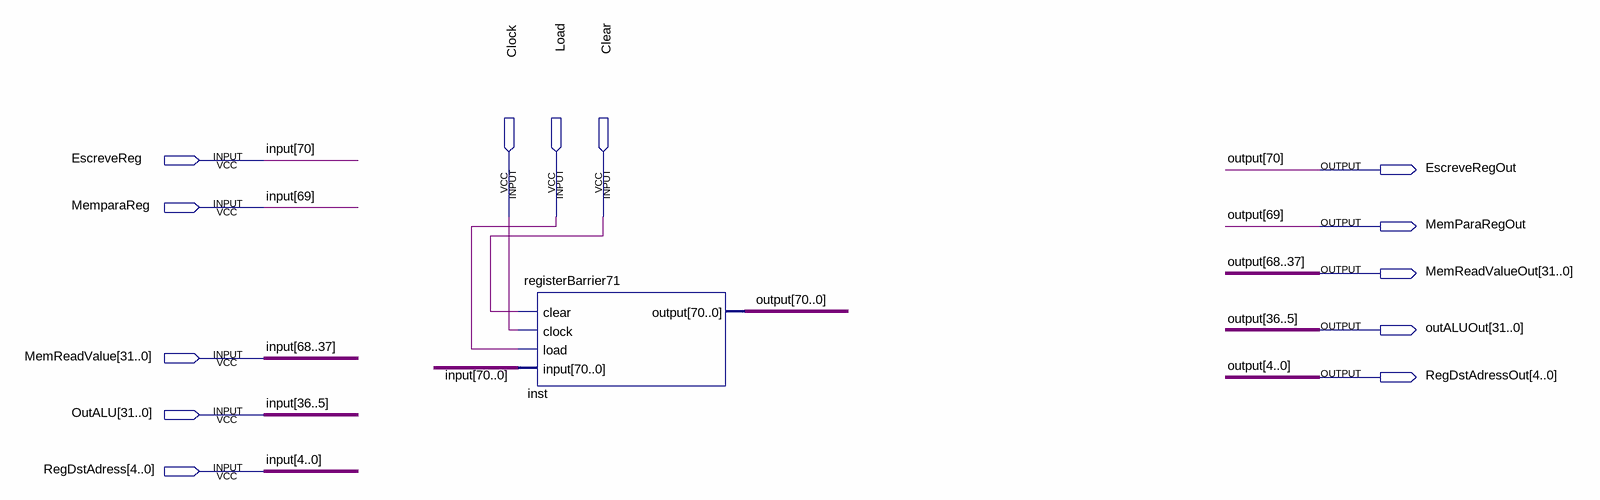
[diagram p0: schematic sheet]
// Quartus schematic MEMWB.bdf as structural Verilog: 1 symbols, 13 pins
module MEMWB (
  input  EscreveReg,
  input  MemparaReg,
  input  Clock,
  input  Load,
  input  Clear,
  input  [31:0] MemReadValue,
  input  [31:0] OutALU,
  input  [4:0] RegDstAdress,
  output EscreveRegOut,
  output MemParaRegOut,
  output [31:0] MemReadValueOut,
  output [31:0] outALUOut,
  output [4:0] RegDstAdressOut
);

  registerBarrier71 inst (
    .clear(Clear), .clock(Clock), .load(Load),
    .\input ({EscreveReg, MemparaReg, MemReadValue, OutALU, RegDstAdress}),
    .\output ({EscreveRegOut, MemParaRegOut, MemReadValueOut, outALUOut, RegDstAdressOut}));

  // Other names for the same wires on the sheet: input[70:0] = {EscreveReg, MemparaReg, MemReadValue, OutALU, RegDstAdress};
  //   output[70:0] = {EscreveRegOut, MemParaRegOut, MemReadValueOut, outALUOut, RegDstAdressOut}
endmodule
